# Altium schematic sheet button_peripheral.SchDoc
size A4
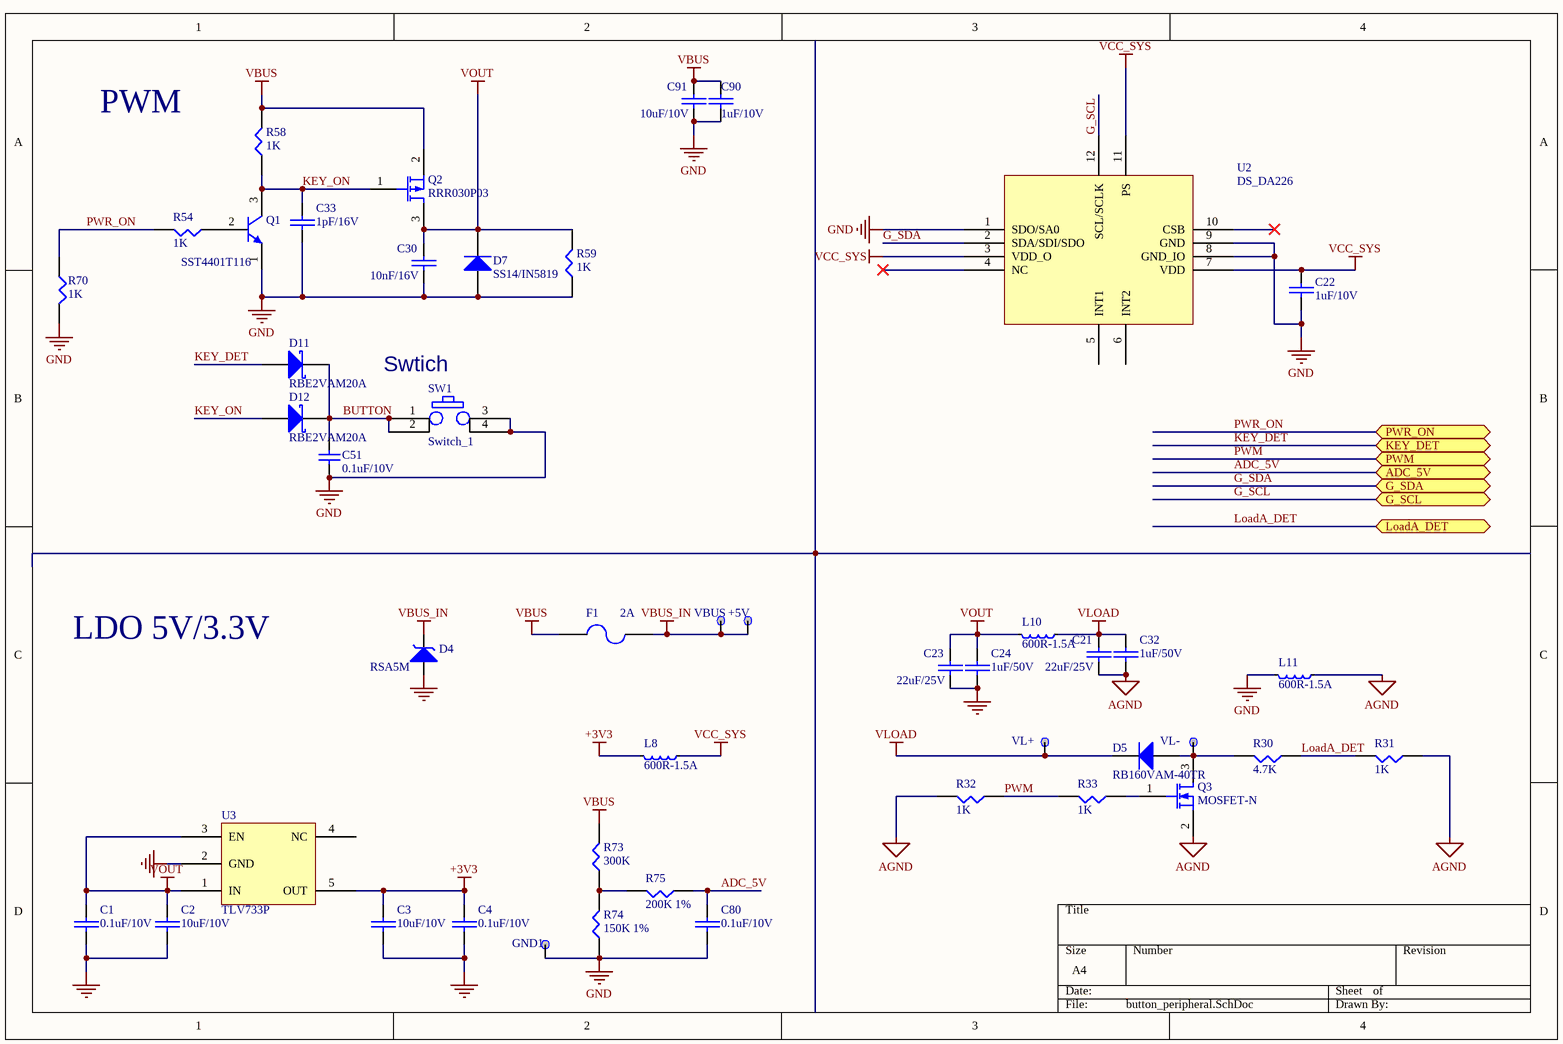
[diagram p0: button_peripheral.SchDoc]

## Parts
+5V  TP  [TESTPOINT2]  (value not drawn)
C1  0.1uF/10V  [0402C]
C2  10uF/10V  [0603C]
C3  10uF/10V  [0603C]
C4  0.1uF/10V  [0402C]
C21  22uF/25V  [0603C]
C22  1uF/10V  [0402C]
C23  22uF/25V  [0603C]
C24  1uF/50V  [0402C]
C30  10nF/16V  [0402C]
C32  1uF/50V  [0402C]
C33  1pF/16V  [0402C]
C51  0.1uF/10V  [0402C]
C80  0.1uF/10V  [0402C]
C90  1uF/10V  [0603C]
C91  10uF/10V  [LC-CASE-P_2012]
D4  RSA5M  [SOD-123]
D5  RB160VAM-40TR  [PROGRAM_1/2]
D7  SS14/IN5819  [PROGRAM_1/2]
D11  RBE2VAM20A  [TUMD2M]
D12  RBE2VAM20A  [TUMD2M]
F1  2A  [1206-FUSE - duplicate]
GND1  TP  [TESTPOINT_PAD]  (value not drawn)
L8  600R-1.5A  [L_0603]
L10  600R-1.5A  [L_0603]
L11  600R-1.5A  [L_0603]
Q1  SST4401T116  [LC-SOT-23(SOT-23-3)]
Q2  RRR030P03  [TSMT3]
Q3  MOSFET-N  [TSMT3]
R30  4.7K  [0402R]
R31  1K  [0402R]
R32  1K  [0402R]
R33  1K  [0402R]
R54  1K  [0402R]
R58  1K  [0402R]
R59  1K  [0402R]
R70  1K  [0402R]
R73  300K  [0402R]
R74  150K 1%  [0402R]
R75  200K 1%  [0402R]
SW1  Switch_1  [KEY_Panasonic]
U2  DS_DA226  [LGA-12]
U3  TLV733P  [SOT-23-5]
VBUS  TP  [TESTPOINT_PAD]  (value not drawn)
VL+  TP  [TESTPOINT_PAD]  (value not drawn)
VL-  TP  [TESTPOINT_PAD]  (value not drawn)

## Ports
ADC_5V, G_SCL, G_SDA, KEY_DET, LoadA_DET, PWM, PWR_ON

## Nets
+3V3: C3.1 C4.1 L8.2 U3.5(OUT)
AGND: C21.2 C32.2 L11.1 Q3.2(S) R31.1 R32.2
GND: C1.2 C2.2 C3.2 C4.2 C22.2 C23.2 C24.2 C30.2 C33.2 C51.1 C80.2 C90.2 C91.2 D4.2(dIode2) D7.2(A) GND1.1 L11.2 Q1.1(E) R59.1 R70.2 R74.1 SW1.3 SW1.4 U2.1(SDO/SA0) U2.8(GND_IO) U2.9(GND) U3.2(GND)
VBUS: C90.1 C91.1 F1.1 Q2.2(S) R58.2 R73.2
VBUS_IN: +5V.1 D4.1(Diode1) F1.2 VBUS.1
VCC_SYS: C22.1 L8.1 U2.3(VDD_O) U2.7(VDD) U2.11(PS)
VLOAD: C21.1 C32.1 D5.1(K) L10.1 VL+.1
VOUT: C1.1 C2.1 C23.1 C24.1 C30.1 D7.1(K) L10.2 Q2.3(D) R59.2 U3.1(IN) U3.3(EN)
ADC_5V: C80.1 R75.1 ; port ADC_5V
BUTTON: C51.2 D11.2(K) D12.2(K) SW1.1 SW1.2
G_SCL: U2.12(SCL/SCLK) ; port G_SCL
G_SDA: U2.2(SDA/SDI/SDO) ; port G_SDA
KEY_DET: D11.1(A) ; port KEY_DET
KEY_ON: C33.1 D12.1(A) Q1.3(C) Q2.1(G) R58.1
LoadA_DET: R30.1 R31.2 ; port LoadA_DET
PWM: R32.1 R33.2 ; port PWM
PWR_ON: R54.2 R70.1 ; port PWR_ON
NetD5_2: D5.2(A) Q3.3(D) R30.2 VL-.1
NetQ1_2: Q1.2(B) R54.1
NetQ3_1: Q3.1(G) R33.1
NetR73_1: R73.1 R74.2 R75.2

Not connected (* = marked no-connect by the designer): U2 4(NC)* 5(INT1) 6(INT2) 10(CSB)*; U3 4(NC)

## Notes on the sheet
- PWM
- (near SW1) Swtich
- LDO 5V/3.3V

## Library data of the parts
+5V GND1 VBUS VL+ VL- = TP: Ordered by: Subcon
C1 C4 C22 C24 C30 C32 C33 C80 = CAP: 厂家：Murata，型号：GRM155R71A104KA01D
C2 C3 C21 C23 C90 C91 = CAP: 厂家：Murata，型号：GRM188R61A106KE69D
C51 = CAP: Capacitor; Value: 100pF; Ordered by: Subcon; Published: 8-Jun-2000; Revision: July-2002: Re-released for DXP Platform.; Publisher: Altium Limited
D4 = ESD_1: 厂家：ROHM，型号：VMNZC6.8CST2RA
D5 D7 = Diode 1N4148: High Conductance Fast Diode
D11 D12 = D Schottky: Schottky Diode; Manuf_Part_1: STPS1L40M; Code - JEDEC: DO-214-AA; Ordered by: ST; Ref St: 9151085; ECCN_US/EU: EAR99/NEC; Published: 8-Jun-2000; Revision: July-2002: Re-released for DXP Platform.; Publisher: Altium Limited; Manuf_1: ST
F1 = FUSE2: 厂家：万瑞和，型号：smd1206-200
L8 L10 L11 = L0402-27n: High frequency chip inductor ±5%; Manufacturer: Murata; Manufacturer Part Number: LQP15MN27NG02D; Value: 27nH; Note: High frequency chip inductor ±2%; Artikkelnr Noca: N.A.; Part Number: L0402-27n; Datasheet: http://search.murata.co.jp/Ceramy/image/img/PDF/ENG/L0075S0084LQP15M.pdf; LatestRevisionDate: 2014-09-17; Pin Count: 2; Publisher: Nordic Semiconductor; Published: 2014-06-12; Supplier: Digi-Key; Supplier part number: 490-6751-1-ND; 2nd source Supplier: *; 2nd source part number: *; Footprint Doc: 0402; Artikkelnr Simpro: N.A.
Q1 = 2N39: NPN General Purpose Amplifier; Published: 8-Jun-2000; LatestRevisionDate: 15-Jan-2003; LatestRevisionNote: PCB Footprint 'BCY-W3/D4.7' replaced; DatasheetVersion: 1997; PackageVersion: Sep-1998; PackageReference: TO-92A; Publisher: Altium Limited; PackageDescription: TO, Flat Index; 3 In-Line, Axial Leads; Body Dia. 4.5mm; Leads 0.51 x 0.48 mm (max); ComponentLink1Description: Manufacturer Link; ComponentLink1URL: http://www.fairchildsemi.com/; ComponentLink2Description: Datasheet; ComponentLink2URL: http://www.fairchildsemi.com/ds/2N%2F2N3904.pdf
Q2 = MOSFET: P-Channel MOSFET; Published: 8-Jun-2000; LatestRevisionDate: 17-Jul-2002; LatestRevisionNote: Re-released for DXP Platform.; PackageVersion: 1995/1996; PackageReference: E3; Publisher: Altium Limited; PackageDescription: TO, Flat Index; 3 In-Line, Axial Leads; Body Dia. 4.6mm; Lead Dia. 0.5 mm (max)
Q3 = MOSFET: N-Channel MOSFET; Published: 8-Jun-2000; LatestRevisionDate: 17-Jul-2002; LatestRevisionNote: Re-released for DXP Platform.; PackageVersion: 1995/1996; PackageReference: E3; Publisher: Altium Limited; PackageDescription: TO, Flat Index; 3 In-Line, Axial Leads; Body Dia. 4.6mm; Lead Dia. 0.5 mm (max)
R30-R33 R54 R58 R59 R70 R73-R75 = RES1: 厂家：Yageo，型号：RC0402FR-0720RL
SW1 = Switch_1: 厂家：松下，型号：EVQPLMA15
U2 = LIS2DE12: 厂家：ST，型号：LIS2DH12
U3 = AP3410